# EasyEDA schematic SCH_stmsheild_2026-06-30.json
TITLE: Sheet_1; REV: 1.0; Date: 2024-12-12; Sheet: 1/1; Drawn By: malekhmadi; Company: Your Company
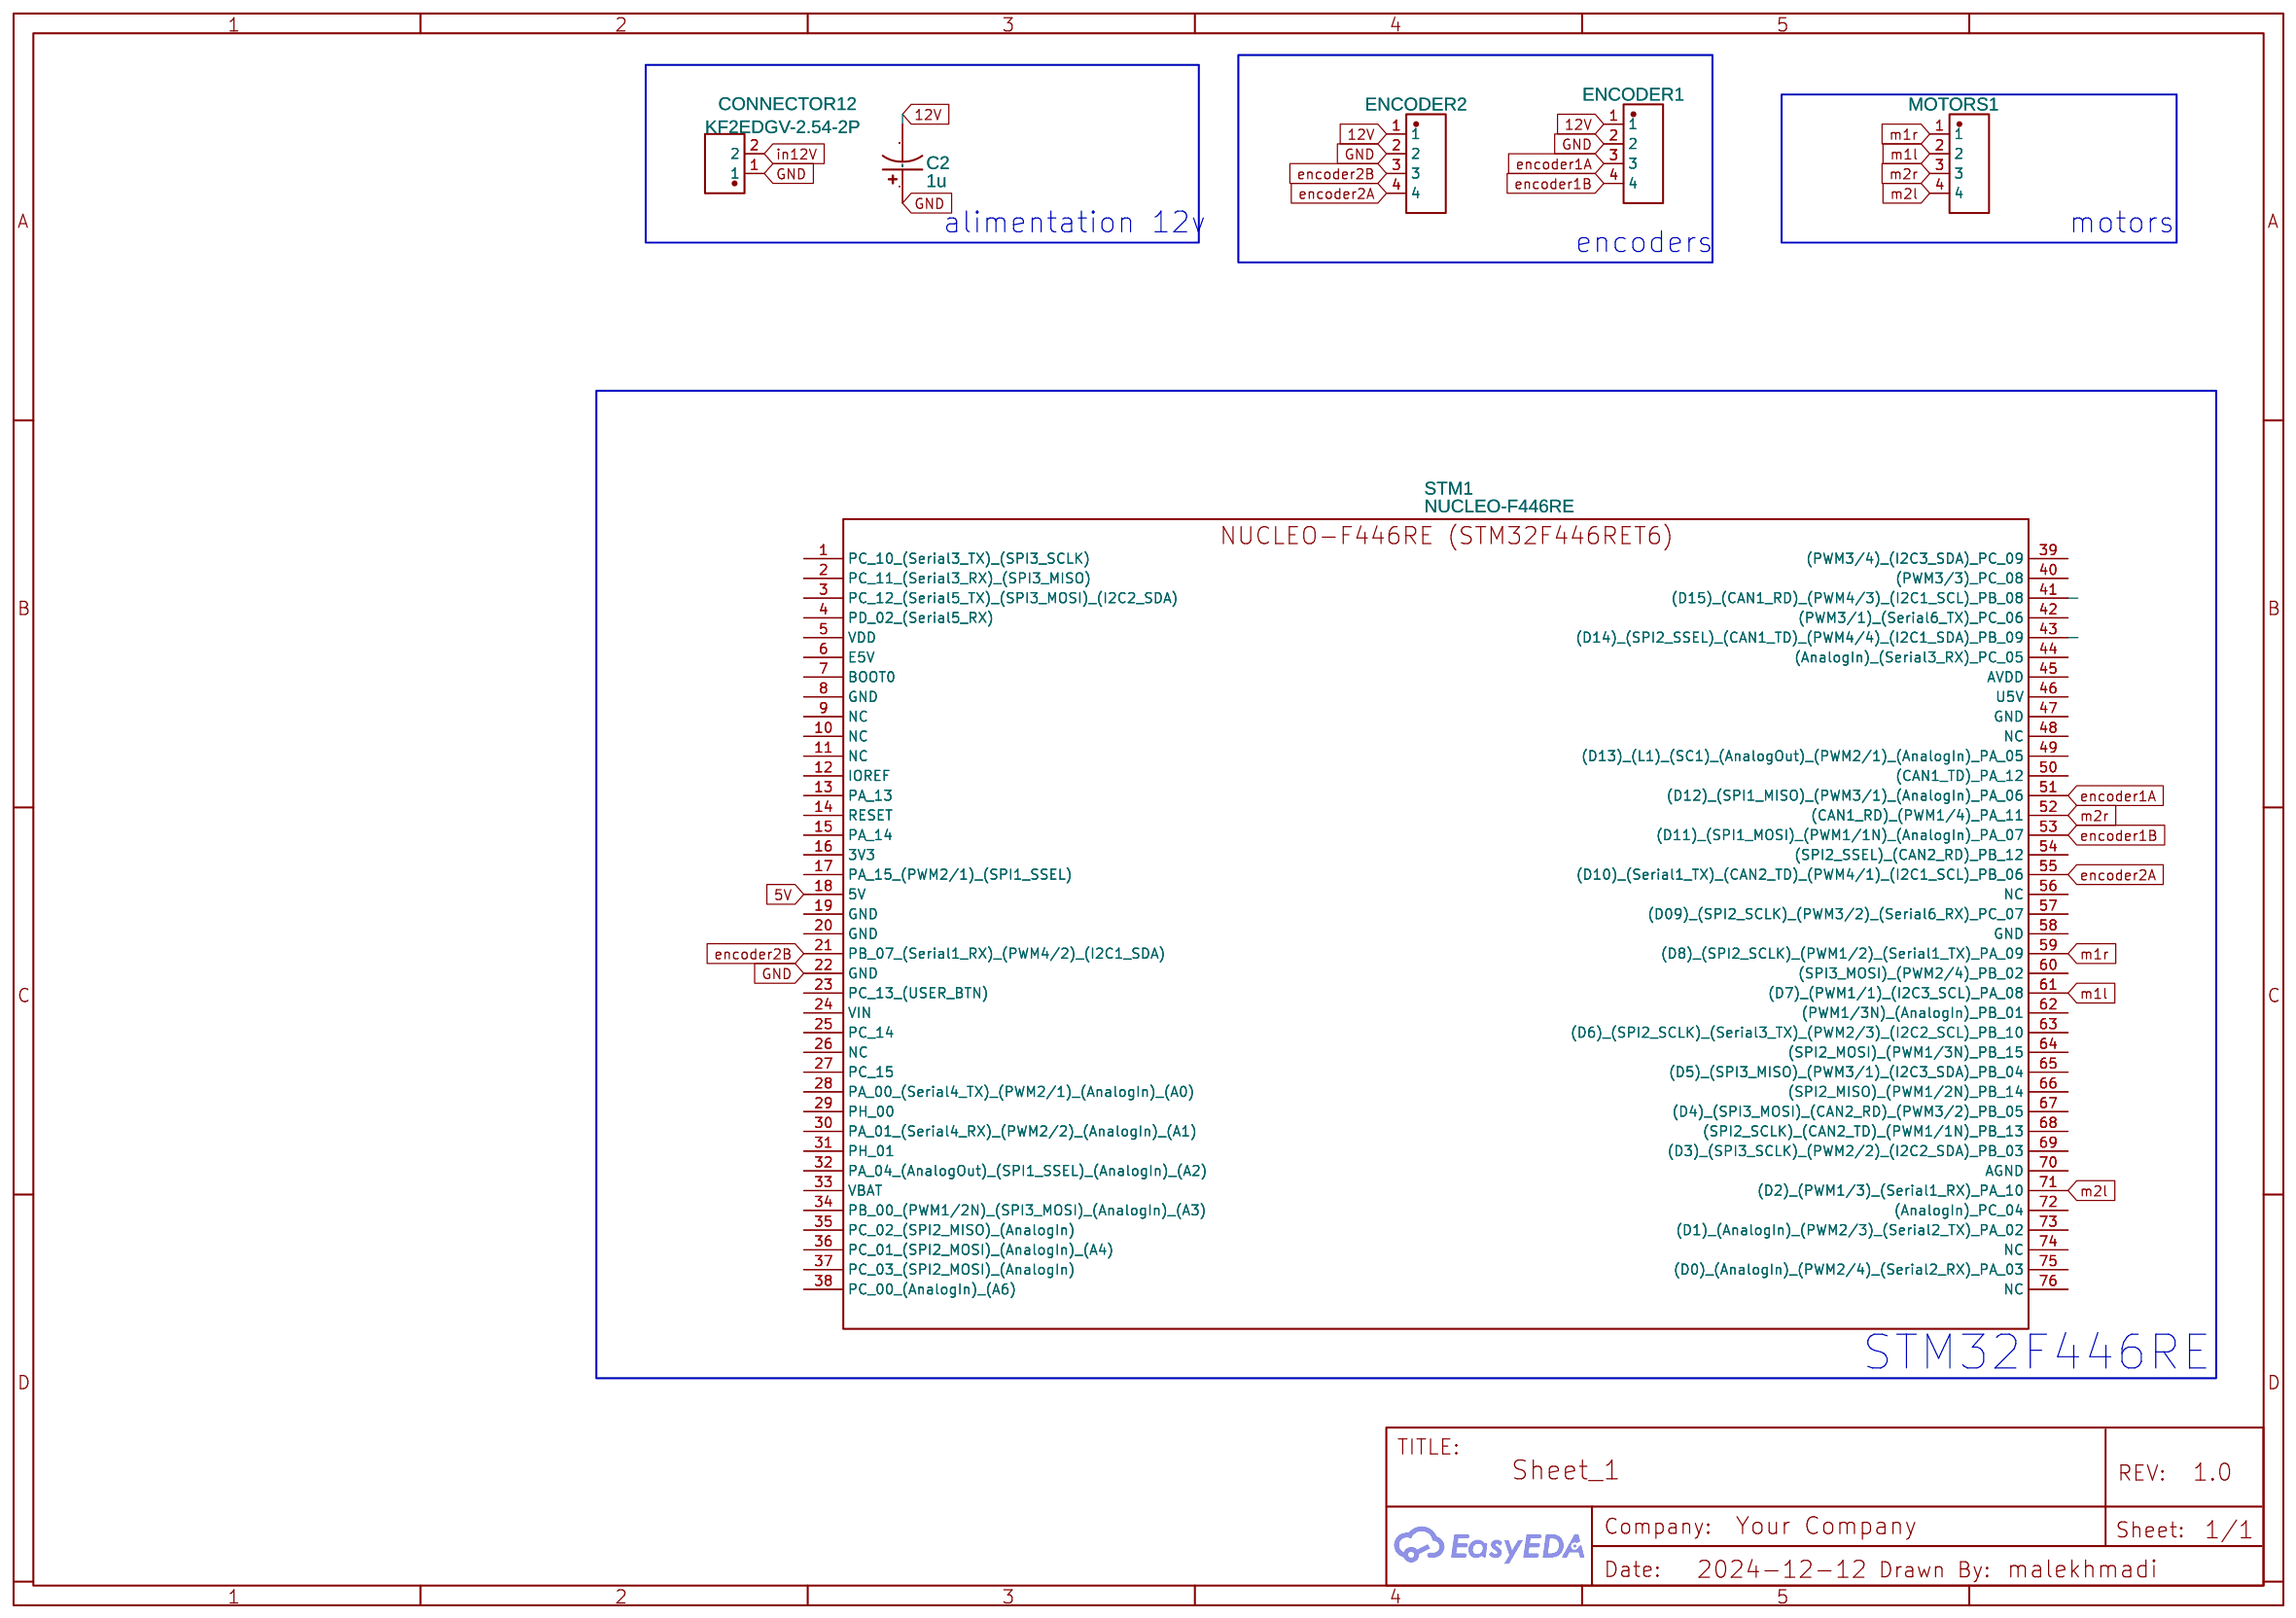
[diagram p0: schematic sheet]

## Parts
C2  1u  [CAP-D4.0×F1.5]
CONNECTOR12  KF2EDGV-2.54-2P  [CONN-TH_KF2EDGV-2.54-2P]
ENCODER1  HC-XHB-4A  [CONN-TH_4P-P2.50_HCTL_HC-XHB-4A]
ENCODER2  HC-XHB-4A  [CONN-TH_4P-P2.50_HCTL_HC-XHB-4A]
MOTORS1  HC-XHB-4A  [CONN-TH_4P-P2.50_HCTL_HC-XHB-4A]
STM1  NUCLEO-F446RE  [NUCLEO F446RE]

## Library data of the parts
C2 = CE_TH_D4.0×F1.5_US: Contributor: LCEDA_Lib
CONNECTOR12 = KF2EDGV-2.54-2P: Supplier: LCSC; Supplier Part: C577535; Manufacturer: Cixi Kefa Elec; Contributor: LCSC; JLCPCB Part Class: Extended Part
ENCODER1 ENCODER2 MOTORS1 = HC-XHB-4A: Supplier: LCSC; Supplier Part: C2845492; Manufacturer: HCTL(华灿天禄); Contributor: LCSC; JLCPCB Part Class: Extended Part
STM1 = NUCLEO-F446RE: Supplier Part: STM32F446RET6; Supplier: STM; link: https://developer.mbed.org/platforms/ST-Nucleo-F446RE/; Contributor: maru shige

## Nets
5V: STM1.18(5V)
12V: C2.2 ENCODER1.1 ENCODER2.1
GND: C2.1 CONNECTOR12.1 ENCODER1.2 ENCODER2.2 STM1.22(GND)
encoder1A: ENCODER1.3 STM1.51((D12) (SPI1_MISO) (PWM3/1) (AnalogIn) PA_06)
encoder1B: ENCODER1.4 STM1.53((D11) (SPI1_MOSI) (PWM1/1N) (AnalogIn) PA_07)
encoder2A: ENCODER2.4 STM1.55((D10) (Serial1_TX) (CAN2_TD) (PWM4/1) (I2C1_SCL) PB_06)
encoder2B: ENCODER2.3 STM1.21(PB_07 (Serial1_RX) (PWM4/2) (I2C1_SDA))
in12V: CONNECTOR12.2
m1l: MOTORS1.2 STM1.61((D7) (PWM1/1) (I2C3_SCL) PA_08)
m1r: MOTORS1.1 STM1.59((D8) (SPI2_SCLK) (PWM1/2) (Serial1_TX) PA_09)
m2l: MOTORS1.4 STM1.71((D2) (PWM1/3) (Serial1_RX) PA_10)
m2r: MOTORS1.3 STM1.52((CAN1_RD) (PWM1/4) PA_11)

Not connected (* = marked no-connect by the designer): STM1 1(PC_10 (Serial3_TX) (SPI3_SCLK)) 2(PC_11 (Serial3_RX) (SPI3_MISO)) 3(PC_12 (Serial5_TX) (SPI3_MOSI) (I2C2_SDA)) 4(PD_02 (Serial5_RX)) 5(VDD) 6(E5V) 7(BOOT0) 8(GND) 9(NC) 10(NC) 11(NC) 12(IOREF) 13(PA) 14(RESET) 15(PA_14) 16(3V3) 17(PA_15 (PWM2/1) (SPI1_SSEL)) 19(GND) 20(GND) 23(PC_13 (USER_BTN)) 24(VIN) 25(PC_14) 26(NC) 27(PC_15) 28(PA_00 (Serial4_TX) (PWM2/1) (AnalogIn) (A0)) 29(PH_00) 30(PA_01 (Serial4_RX) (PWM2/2) (AnalogIn) (A1)) 31(PH_01) 32(PA_04 (AnalogOut) (SPI1_SSEL) (AnalogIn) (A2)) 33(VBAT) 34(PB_00 (PWM1/2N) (SPI3_MOSI) (AnalogIn) (A3)) 35(PC_02 (SPI2_MISO) (AnalogIn)) 36(PC_01 (SPI2_MOSI) (AnalogIn) (A4)) 37(PC_03 (SPI2_MOSI) (AnalogIn)) 38(PC_00 (AnalogIn) (A6)) 39((PWM3/4) (I2C3_SDA) PC_09) 40((PWM3/3) PC_08) 41((D15) (CAN1_RD) (PWM4/3) (I2C1_SCL) PB_08) 42((PWM3/1) (Serial6_TX) PC_06) 43((D14) (SPI2_SSEL) (CAN1_TD) (PWM4/4) (I2C1_SDA) PB_09) 44((AnalogIn) (Serial3_RX) PC_05) 45(AVDD) 46(U5V) 47(GND) 48(NC) 49((D13) (L1) (SC1) (AnalogOut) (PWM2/1) (AnalogIn) PA_05) 50((CAN1_TD) PA_12) 54((SPI2_SSEL) (CAN2_RD) PB_12) 56(NC) 57((D09) (SPI2_SCLK) (PWM3/2) (Serial6_RX) PC_07) 58(GND) 60((SPI3_MOSI) (PWM2/4) PB_02) 62((PWM1/3N) (AnalogIn) PB_01) 63((D6) (SPI2_SCLK) (Serial3_TX) (PWM2/3) (I2C2_SCL) PB_10) 64((SPI2_MOSI) (PWM1/3N) PB_15) 65((D5) (SPI3_MISO) (PWM3/1) (I2C3_SDA) PB_04) 66((SPI2_MISO) (PWM1/2N) PB_14) 67((D4) (SPI3_MOSI) (CAN2_RD) (PWM3/2) PB_05) 68((SPI2_SCLK) (CAN2_TD) (PWM1/1N) PB_13) 69((D3) (SPI3_SCLK) (PWM2/2) (I2C2_SDA) PB_03) 70(AGND) 72((AnalogIn) PC_04) 73((D1) (AnalogIn) (PWM2/3) (Serial2_TX) PA_02) 74(NC) 75((D0) (AnalogIn) (PWM2/4) (Serial2_RX) PA_03) 76(NC)

## Notes on the sheet
- alimentation 12v
- motors
- encoders
- STM32F446RE
